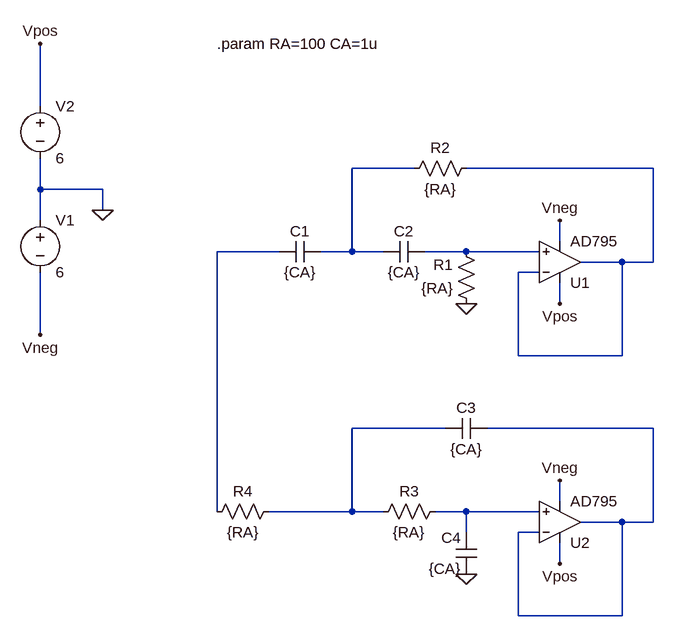
[diagram p0: schematic Draft2.asc]
Draft2.asc, the LTspice schematic file:
Version 4
SHEET 1 928 680
WIRE -544 -208 -544 -304
WIRE 32 -112 -64 -112
WIRE 400 -112 112 -112
WIRE -544 -80 -544 -128
WIRE -448 -80 -544 -80
WIRE -448 -48 -448 -80
WIRE -544 -32 -544 -80
WIRE 256 0 256 -32
WIRE -176 16 -272 16
WIRE -64 16 -64 -112
WIRE -64 16 -112 16
WIRE -16 16 -64 16
WIRE 112 16 48 16
WIRE 224 16 112 16
WIRE 352 32 288 32
WIRE 400 32 400 -112
WIRE 400 32 352 32
WIRE 224 48 192 48
WIRE 256 96 256 64
WIRE -544 144 -544 48
WIRE 192 176 192 48
WIRE 352 176 352 32
WIRE 352 176 192 176
WIRE 80 288 -64 288
WIRE 400 288 144 288
WIRE 256 400 256 368
WIRE -272 416 -272 16
WIRE -64 416 -64 288
WIRE -64 416 -192 416
WIRE -16 416 -64 416
WIRE 112 416 64 416
WIRE 224 416 112 416
WIRE 352 432 288 432
WIRE 400 432 400 288
WIRE 400 432 352 432
WIRE 112 448 112 416
WIRE 224 448 192 448
WIRE 256 496 256 464
WIRE 192 576 192 448
WIRE 352 576 352 432
WIRE 352 576 192 576
FLAG 112 96 0
FLAG 112 512 0
FLAG -448 -48 0
FLAG -544 -304 Vpos
FLAG -544 144 Vneg
FLAG 256 -32 Vneg
FLAG 256 368 Vneg
FLAG 256 96 Vpos
FLAG 256 496 Vpos
SYMBOL OpAmps\\AD795 256 96 M180
SYMATTR InstName U1
SYMBOL OpAmps\\AD795 256 496 M180
SYMATTR InstName U2
SYMBOL res 128 112 R180
WINDOW 0 36 76 Left 2
WINDOW 3 36 40 Left 2
SYMATTR InstName R1
SYMATTR Value {RA}
SYMBOL res 16 -96 R270
WINDOW 0 32 56 VTop 2
WINDOW 3 0 56 VBottom 2
SYMATTR InstName R2
SYMATTR Value {RA}
SYMBOL res -32 432 R270
WINDOW 0 32 56 VTop 2
WINDOW 3 0 56 VBottom 2
SYMATTR InstName R3
SYMATTR Value {RA}
SYMBOL res -288 432 R270
WINDOW 0 32 56 VTop 2
WINDOW 3 0 56 VBottom 2
SYMATTR InstName R4
SYMATTR Value {RA}
SYMBOL cap -112 0 R90
WINDOW 0 0 32 VBottom 2
WINDOW 3 32 32 VTop 2
SYMATTR InstName C1
SYMATTR Value {CA}
SYMBOL cap 48 0 R90
WINDOW 0 0 32 VBottom 2
WINDOW 3 32 32 VTop 2
SYMATTR InstName C2
SYMATTR Value {CA}
SYMBOL cap 144 272 R90
WINDOW 0 0 32 VBottom 2
WINDOW 3 32 32 VTop 2
SYMATTR InstName C3
SYMATTR Value {CA}
SYMBOL cap 128 512 R180
WINDOW 0 24 56 Left 2
WINDOW 3 24 8 Left 2
SYMATTR InstName C4
SYMATTR Value {CA}
SYMBOL voltage -544 -48 R0
WINDOW 123 0 0 Left 0
WINDOW 39 0 0 Left 0
SYMATTR InstName V1
SYMATTR Value 6
SYMBOL voltage -544 -224 R0
WINDOW 123 0 0 Left 0
WINDOW 39 0 0 Left 0
SYMATTR InstName V2
SYMATTR Value 6
TEXT -272 -304 Left 2 !.param RA=100 CA=1u

The netlist it stands for:
* Draft2.asc
XU1 N004 N002 Vpos Vneg N002 AD795  ; pins In+ In- V+ V- OUT
XU2 N007 N006 Vpos Vneg N006 AD795  ; pins In+ In- V+ V- OUT
R1 0 N004 {RA}
R2 N001 N002 {RA}
R3 N005 N007 {RA}
R4 N003 N005 {RA}
C1 N001 N003 {CA}
C2 N004 N001 {CA}
C3 N006 N005 {CA}
C4 0 N007 {CA}
V1 0 Vneg 6
V2 Vpos 0 6
.param RA=100 CA=1u
.lib ADI1.lib
.backanno
.end